# Altium schematic sheet prog-debug.schdoc
size 297 x 209 mm; Symbol: Drawing-Symbol_A4; @Project Name: Odin; @Page Count: 8; @Update Date: 2025-12-15; @Create Date: 2025-10-16; @Schematic Name: Odin; @Page No: 7; @Page Name: prog-debug; Company: EasyEDA.com; Version: V1.0; Page Size: A4; @Create Time: 15:54:24; @Update Time: 10:48:31; Border: 1; Width: 1170; Height: 825; Region Start: 1; X Region Count: 6; Y Region Count: 4; Blade Width: 10; Title Block Position: 3; @Board Name: Odin_V1.0.0; Device: Drawing-Symbol_A4
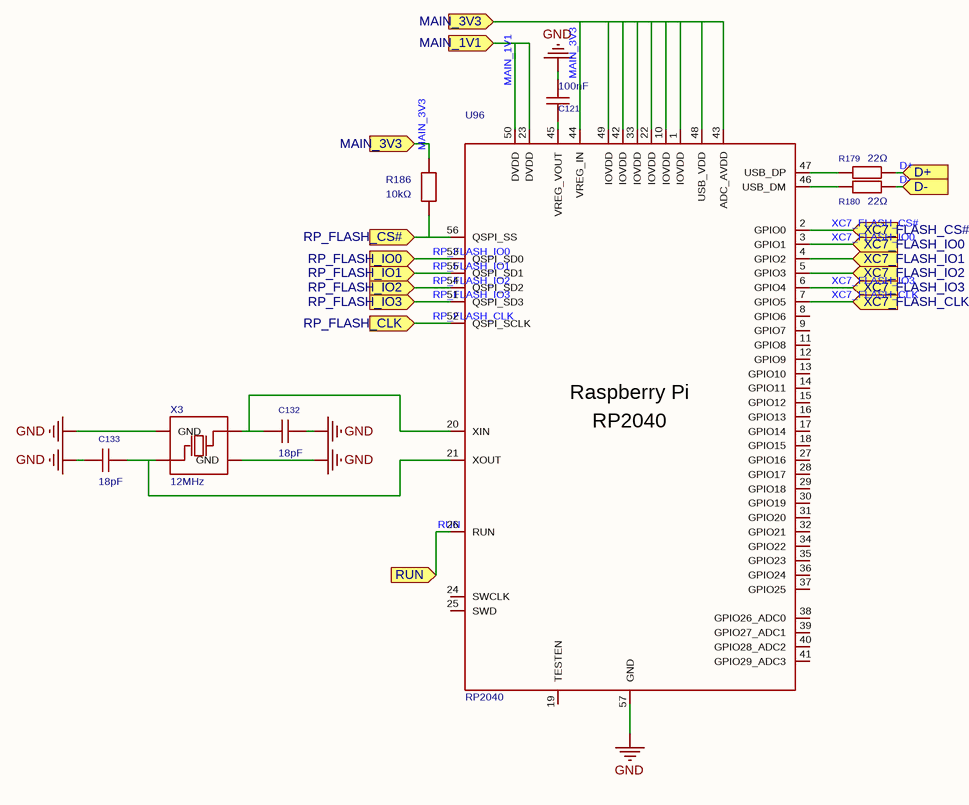
[diagram p0: prog-debug.schdoc]

## Parts
C121  100nF  [C0603]
C132  18pF  [C0603]
C133  18pF  [C0603]
R179  22Ω  [R0402]
R180  22Ω  [R0402]
R186  10kΩ  [R0402]
U96  RP2040  [LQFN-56_L7.0-W7.0-P0.4-EP]
X3  12MHz  [CRYSTAL-SMD_4P-L3.2-W2.5-BL]

## Ports
D+ (in), D- (in), MAIN_1V1 (in), MAIN_3V3 (in), RP_FLASH_CLK (in), RP_FLASH_CS# (in), RP_FLASH_IO0 (in), RP_FLASH_IO1 (in), RP_FLASH_IO2 (in), RP_FLASH_IO3 (in), RUN (in), XC7_FLASH_CLK (in), XC7_FLASH_CS# (in), XC7_FLASH_IO0 (in), XC7_FLASH_IO1 (in), XC7_FLASH_IO2 (in), XC7_FLASH_IO3 (in)

## Nets
GND: C121.2 C132.2 C133.2 U96.57(GND) X3.2(GND) X3.4(GND)
D+: R179.2 ; port D+
D-: R180.2 ; port D-
MAIN_1V1: U96.23(DVDD) U96.50(DVDD) ; port MAIN_1V1
MAIN_3V3: R186.1 U96.1(IOVDD) U96.10(IOVDD) U96.22(IOVDD) U96.33(IOVDD) U96.42(IOVDD) U96.43(ADC_AVDD) U96.44(VREG_IN) U96.48(USB_VDD) U96.49(IOVDD) ; port MAIN_3V3
RP_FLASH_CLK: U96.52(QSPI_SCLK) ; port RP_FLASH_CLK
RP_FLASH_CS#: R186.2 U96.56(QSPI_SS) ; port RP_FLASH_CS#
RP_FLASH_IO0: U96.53(QSPI_SD0) ; port RP_FLASH_IO0
RP_FLASH_IO1: U96.55(QSPI_SD1) ; port RP_FLASH_IO1
RP_FLASH_IO2: U96.54(QSPI_SD2) ; port RP_FLASH_IO2
RP_FLASH_IO3: U96.51(QSPI_SD3) ; port RP_FLASH_IO3
RUN: U96.26(RUN) ; port RUN
XC7_FLASH_CLK: U96.7(GPIO5) ; port XC7_FLASH_CLK
XC7_FLASH_CS#: U96.2(GPIO0) ; port XC7_FLASH_CS#
XC7_FLASH_IO0: U96.3(GPIO1) ; port XC7_FLASH_IO0
XC7_FLASH_IO1: U96.4(GPIO2) ; port XC7_FLASH_IO1
XC7_FLASH_IO2: U96.5(GPIO3) ; port XC7_FLASH_IO2
XC7_FLASH_IO3: U96.6(GPIO4) ; port XC7_FLASH_IO3
NetC121_1: C121.1 U96.45(VREG_VOUT)
NetC132_1: C132.1 U96.20(XIN) X3.3(OSC2)
NetC133_1: C133.1 U96.21(XOUT) X3.1(OSC1)
NetR179_1: R179.1 U96.47(USB_DP)
NetR180_1: R180.1 U96.46(USB_DM)

Not connected (* = marked no-connect by the designer): U96 8(GPIO6) 9(GPIO7) 11(GPIO8) 12(GPIO9) 13(GPIO10) 14(GPIO11) 15(GPIO12) 16(GPIO13) 17(GPIO14) 18(GPIO15) 19(TESTEN) 24(SWCLK) 25(SWD) 27(GPIO16) 28(GPIO17) 29(GPIO18) 30(GPIO19) 31(GPIO20) 32(GPIO21) 34(GPIO22) 35(GPIO23) 36(GPIO24) 37(GPIO25) 38(GPIO26_ADC0) 39(GPIO27_ADC1) 40(GPIO28_ADC2) 41(GPIO29_ADC3)

## Notes on the sheet
- Create at
- 2025-10-16
- Schematic
- Board
- Odin
- Odin_V1.0.0
- Update at
- Page
- 2025-12-15
- prog-debug
- Drawn
- Reviewed
- Version
- V1.0
- Size
- A4
- Page  7  Total  8
- EasyEDA.com
- (in symbol RP2040_C2040) Raspberry Pi

## Library data of the parts
C121 C132 C133 = CL10B223KB8NNNC: Capacitance:22nF Tolerance:±10% Tolerance:±10% Voltage Rating:50V Temperature Coefficient:X7R; Manufacturer: SAMSUNG(三星); AddInBom: yes; ModelId: 624118aa3cc7497086c383c2d72e0852; ModelName: C0603_L1.6-W0.8-H0.8; ModelTransform: 62.992,31.496,0,0,0,0,0,0,0; Tolerance: ±10%; Voltage Rating: 50V; Temperature Coefficient: X7R; Symbol: CL10B223KB8NNNC; Device: CL10B223KB8NNNC; Supplier: LCSC; Manufacturer Part: CL10B223KB8NNNC; JLCPCB Part Class: Basic Part; LCSC Part Name: 22nF ±10% 50V; Supplier Footprint: 0603; Datasheet: https://item.szlcsc.com/datasheet/CL10B223KB8NNNC/21834.html; ConvertToPcb: yes; FootprintName: C0603
  C121: Value: 100nF
  C132 C133: Value: 18pF
R179 R180 = 0402WGF220JTCE: Type:Thick Film Resistors Resistance:22Ω Tolerance:±1% Tolerance:±1% Power(Watts): Overload Voltage (Max): Temperature Coefficient:±100ppm/℃ Temperature Coefficient:±100ppm/℃ Operating Temperature Range:-55℃~+155℃ Operating Temperature Range:-55℃~+155℃; Manufacturer: UNI-ROYAL(厚声); AddInBom: yes; ModelId: efdecb7dae4442949d28eecaf748420f; ModelName: R0402_L1.0-W0.5-H0.4; ModelTransform: 39.37,19.685,0,0,0,0,0,0,0; Tolerance: ±1%; Symbol: 0402WGF220JTCE; Device: 0402WGF220JTCE; Supplier: LCSC; Manufacturer Part: 0402WGF220JTCE; Supplier Part: C25092; Value: 22Ω; JLCPCB Part Class: Basic Part; LCSC Part Name: 22Ω ±1% 62.5mW 厚膜电阻; Supplier Footprint: 0402; Datasheet: https://atta.szlcsc.com/upload/public/pdf/source/20200306/C422600_1E6D84923E4A46A82E41ADD87F860B5C.pdf; ConvertToPcb: yes; FootprintName: R0402; Type: Thick Film Resistors; Temperature Coefficient: ±100ppm/℃; Operating Temperature Range: -55℃~+155℃
R186 = FRC0402F3002TS: Type:Thick Film Resistor Resistance:30kΩ Tolerance:±1% Tolerance:±1% Power(Watts):62.5mW Voltage-Supply(Max):50V Temperature Coefficient:±100ppm/℃ Temperature Coefficient:±100ppm/℃ Operating Temperature:-55℃~+155℃ Operating Temperature:-55℃~+155℃; Manufacturer: FOJAN(富捷); AddInBom: yes; ModelId: efdecb7dae4442949d28eecaf748420f; ModelName: R0402_L1.0-W0.5-H0.4; ModelTransform: 39.37,19.685,0,0,0,0,0,0,0; Tolerance: ±1%; Power(Watts): 62.5mW; Voltage-Supply(Max): 50V; Value: 10kΩ; Symbol: FRC0402F3002TS; Device: FRC0402F3002TS; LCSC Part Name: 30kΩ ±1% 62.5mW 厚膜电阻; ManufacturerPart: FRC0402F3002TS; Supplier Footprint: 0402; JLCPCB Part Class: Extended Part; Supplier: LCSC; ConvertToPcb: yes; FootprintName: R0402; Type: Thick Film Resistor; Temperature Coefficient: ±100ppm/℃; Operating Temperature: -55℃~+155℃
U96 = RP2040_C2040: CPU Core:- CPU Maximum Speed:133MHz Number of I/O:30 ADC (Bit):12bit Applications:-; Manufacturer: Raspberry Pi(树莓派); AddInBom: yes; ModelId: 52a5bd97ade4421ca7c85eb2c0733466; ModelTransform: 276.377,276.377,0,0,0,0,0,0,0; CPU Maximum Speed: 133MHz; Number of I/O: 30; ADC (Bit): 12bit; Symbol: RP2040; Device: RP2040_C2040; LCSC Part Name: RP2040（RP2B2）; SupplierPart: C2040; ManufacturerPart: RP2040; Supplier Footprint: LQFN-56(7x7); JLCPCB Part Class: Extended Part; Datasheet: https://item.szlcsc.com/datasheet/RP2040/2392.html; Supplier: LCSC; ConvertToPcb: yes; FootprintName: LQFN-56_L7.0-W7.0-P0.4-EP; ModelName: LQFN-56_L7.0-W7.0-P0.4-EP; CPU Core: -; Applications: -
X3 = M12000E058: Type:Surface Mount Crystal Frequency:12MHz Normal temperature Frequency Tolerance:±20ppm Normal temperature Frequency Tolerance:±20ppm Load Capacitance: Equivalent Series Resistance(ESR):50Ω Operating Temperature:-20℃~+70℃ Operating Temperature:-20℃~+70℃; Manufacturer: ECEC(东晶); AddInBom: yes; ModelId: 02485e56ba8d4732a26526d2983fc729; ModelTransform: 125.984,98.425,0,0,0,0,0,0,0; Normal temperature Frequency Tolerance: ±20ppm; Equivalent Series Resistance(ESR): 50Ω; Symbol: M12000E058; Device: M12000E058; LCSC Part Name: 12MHz ±20ppm 12pF; SupplierPart: C258938; ManufacturerPart: M12000E058; Supplier Footprint: SMD3225-4P; JLCPCB Part Class: Extended Part; Datasheet: https://atta.szlcsc.com/upload/public/pdf/source/20190117/C280061_15588412114B46B81DE7DD3623721DA1.pdf; Supplier: LCSC; ConvertToPcb: yes; FootprintName: CRYSTAL-SMD_4P-L3.2-W2.5-BL; ModelName: CRYSTAL-SMD_4P-L3.2-W2.5-BL; Type: Surface Mount Crystal; Value: 12MHz; Operating Temperature: -20℃~+70℃